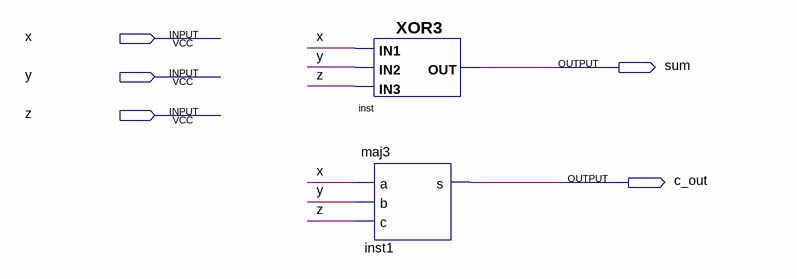
[diagram p0: schematic sheet]
// Quartus schematic mbr_fa.bdf as structural Verilog: 2 symbols, 5 pins
module mbr_fa (
  input  x,
  input  y,
  input  z,
  output sum,
  output c_out
);

  XOR3 inst (.IN3(z), .IN1(x), .IN2(y), .OUT(sum));
  maj3 inst1 (.a(x), .b(y), .c(z), .s(c_out));
endmodule
